# EasyEDA Pro project ProPrj_主控板v1.0_2025-02-24.epro, schematic Schematic2
Board Name: 主控扩展板V1.0; Create Date: 2024-12-04; Page Name: 扩展接口及端子; Project Name: 主控板v1.0; Schematic Name: Schematic2; Update Date: 2024-12-20; Company: 嘉立创EDA; Page Size: A4; Version: V1.0
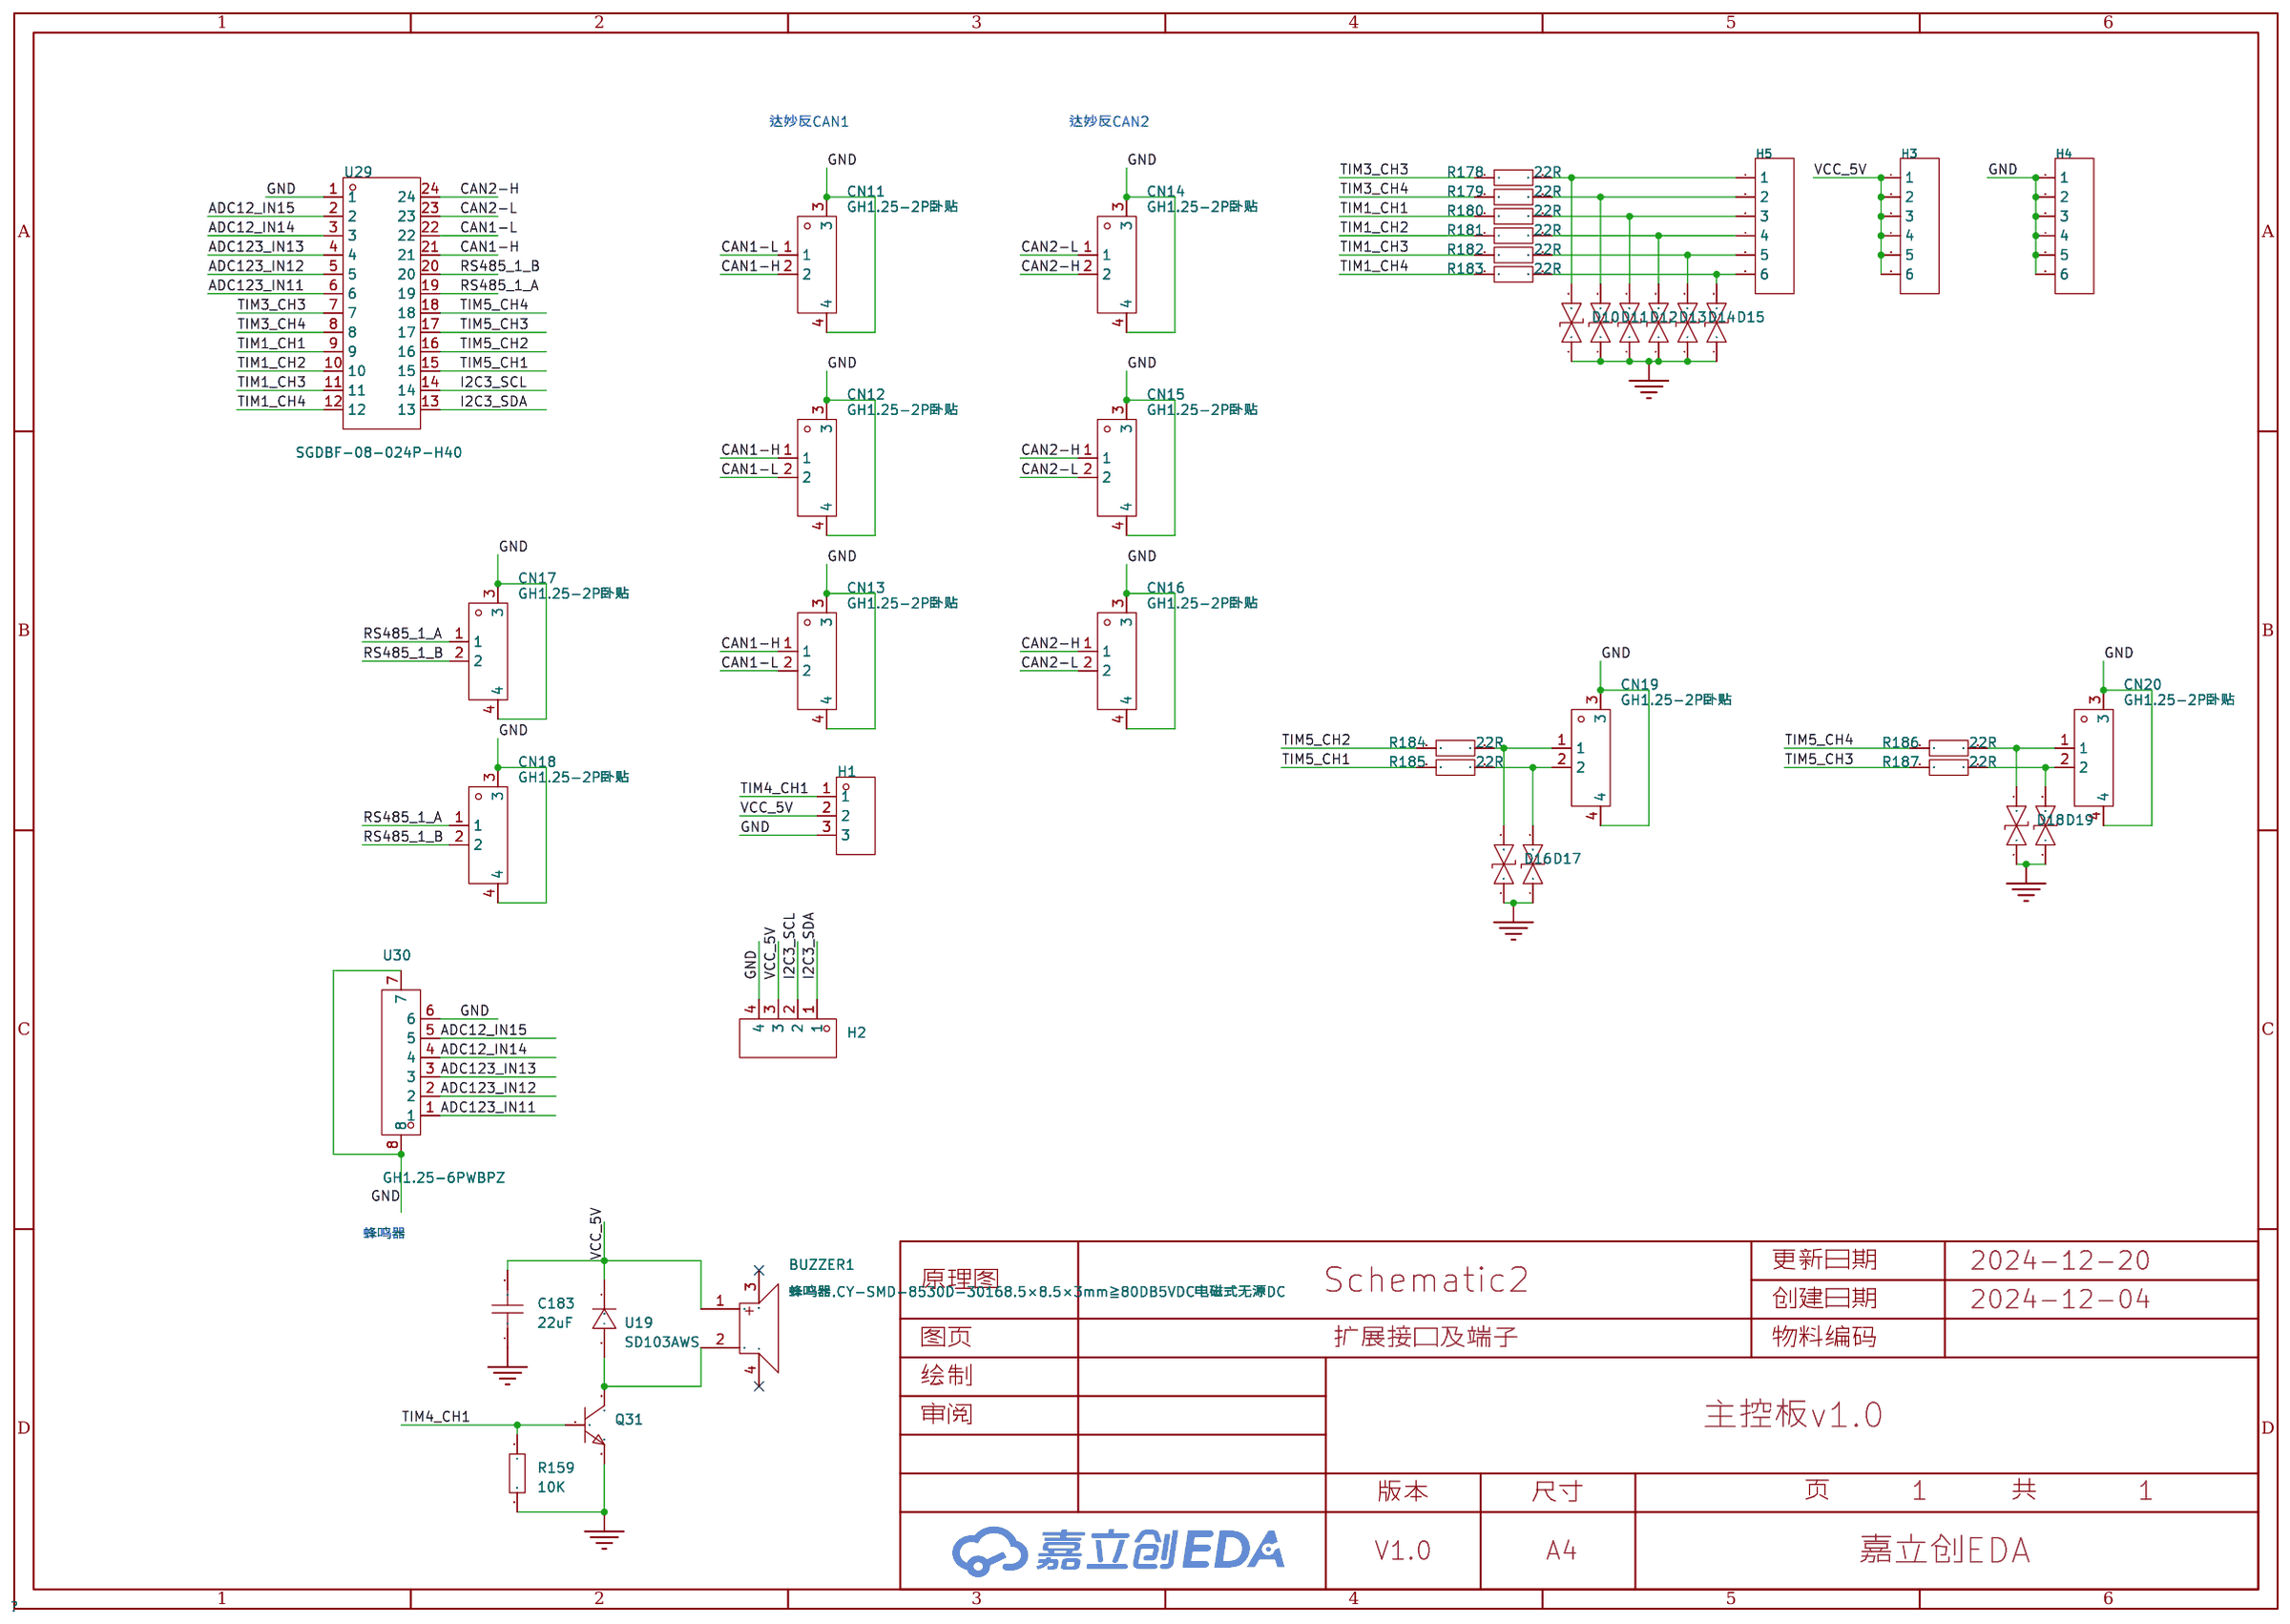
[diagram p6: schematic sheet]

## Parts
BUZZER1  蜂鸣器.CY-SMD-8530D-30168.5×8.5×3mm≧80DB5VDC电磁式无源DC  [BUZ-SMD_4P-L8.5-W8.5-BR-1]
C183  22uF  [C0603]
CN11  GH1.25-2P卧贴  [CONN-SMD_2P-P1.25_X1251WRS-02HF-LPSW]
CN12  GH1.25-2P卧贴  [CONN-SMD_2P-P1.25_X1251WRS-02HF-LPSW]
CN13  GH1.25-2P卧贴  [CONN-SMD_2P-P1.25_X1251WRS-02HF-LPSW]
CN14  GH1.25-2P卧贴  [CONN-SMD_2P-P1.25_X1251WRS-02HF-LPSW]
CN15  GH1.25-2P卧贴  [CONN-SMD_2P-P1.25_X1251WRS-02HF-LPSW]
CN16  GH1.25-2P卧贴  [CONN-SMD_2P-P1.25_X1251WRS-02HF-LPSW]
CN17  GH1.25-2P卧贴  [CONN-SMD_2P-P1.25_X1251WRS-02HF-LPSW]
CN18  GH1.25-2P卧贴  [CONN-SMD_2P-P1.25_X1251WRS-02HF-LPSW]
CN19  GH1.25-2P卧贴  [CONN-SMD_2P-P1.25_X1251WRS-02HF-LPSW]
CN20  GH1.25-2P卧贴  [CONN-SMD_2P-P1.25_X1251WRS-02HF-LPSW]
D10  ESD9B5.0ST5G  [SOD-923_L0.8-W0.6-LS1.0-BI]
D11  ESD9B5.0ST5G  [SOD-923_L0.8-W0.6-LS1.0-BI]
D12  ESD9B5.0ST5G  [SOD-923_L0.8-W0.6-LS1.0-BI]
D13  ESD9B5.0ST5G  [SOD-923_L0.8-W0.6-LS1.0-BI]
D14  ESD9B5.0ST5G  [SOD-923_L0.8-W0.6-LS1.0-BI]
D15  ESD9B5.0ST5G  [SOD-923_L0.8-W0.6-LS1.0-BI]
D16  ESD9B5.0ST5G  [SOD-923_L0.8-W0.6-LS1.0-BI]
D17  ESD9B5.0ST5G  [SOD-923_L0.8-W0.6-LS1.0-BI]
D18  ESD9B5.0ST5G  [SOD-923_L0.8-W0.6-LS1.0-BI]
D19  ESD9B5.0ST5G  [SOD-923_L0.8-W0.6-LS1.0-BI]
H1  -  [HDR-TH_3P-P2.54-V-M]
H2  -  [HDR-TH_4P-P2.54-V-M]
H3  -  [HDR-TH_6P-P2.54-V-M-1]
H4  -  [HDR-TH_6P-P2.54-V-M-1]
H5  -  [HDR-TH_6P-P2.54-V-M-1]
Q31  -  [S8050_SOT-23]
R159  10K  [R0603]
R178  22R  [R0603]
R179  22R  [R0603]
R180  22R  [R0603]
R181  22R  [R0603]
R182  22R  [R0603]
R183  22R  [R0603]
R184  22R  [R0603]
R185  22R  [R0603]
R186  22R  [R0603]
R187  22R  [R0603]
U19  SD103AWS  [SOD-123_L2.7-W1.7-LS3.8-RD]
U29  SGDBF-08-024P-H40  [CONN-SMD_24P-P0.80_SGDBF-08-024P-H40]
U30  GH1.25-6PWBPZ  [CONN-SMD_6P-P1.25_GH1.25-6PWBPZ]

## Library data of the parts
BUZZER1 = 蜂鸣器.CY-SMD-8530D-30168.5×8.5×3mm≧80DB5VDC电磁式无源DC: Supplier Part: C9900015926; Supplier Footprint: SMD; JLCPCB Part Class: 扩展库; Supplier: LCSC
C183 = CAP_0603: Supplier Footprint: 0603
CN11-CN20 = GH1.25-2P卧贴_C9900015099: Supplier Part: C9900015099; JLCPCB Part Class: 扩展库; Supplier: LCSC
D10-D19 = ESD9B5.0ST5G: 极性:双向;反向截止电压(Vrwm):5V;最大钳位电压:-;峰值脉冲功率(Ppp)@10/1000us:-;击穿电压:5.8V;; LCSC Part Name: 双向ESD; Supplier Part: C111566; Manufacturer: onsemi(安森美); Supplier Footprint: SOD-923; JLCPCB Part Class: 扩展库; Datasheet: https://atta.szlcsc.com/upload/public/pdf/source/20170704/1499151283092.PDF; Supplier: LCSC; polarity: 双向; Reverse Stand-Off Voltage (Vrwm): 5V; Breakdown Voltage: 5.8V; Number of Lines: 单路; Operating Temperature: -55℃~+150℃@(Tj); Type: ESD
H1 = HDR-M_2.54_1x3P: Supplier Part: C2937625; Supplier Footprint: 插件
H2 = HDR-M_2.54_1x4P: Supplier Part: C492403; Supplier Footprint: 插件
H3-H5 = HDR-M_2.54_1x6P: Supplier Part: C37208; Supplier Footprint: 插件
Q31 = S8050_SOT_NPN: Supplier Footprint: SOT-23
R159 R178-R187 = Res_0603: Supplier Footprint: 0603
U19 = SD103AWS: Supplier Part: C9900016166; Supplier Footprint: 0805; JLCPCB Part Class: 扩展库; Supplier: LCSC
U29 = SGDBF-08-024P-H40: Supplier Part: C17701770; Supplier Footprint: SMD-24P; JLCPCB Part Class: 扩展库; Supplier: LCSC
U30 = GH1.25-6PWBPZ: LCSC Part Name: GH1.25-6P卧贴编带; Supplier Part: C2829255; Manufacturer: BOOMELE(博穆精密); JLCPCB Part Class: 扩展库; Datasheet: https://atta.szlcsc.com/upload/public/pdf/source/20211125/08A09A4909F58AF780B71FE423A00F7E.pdf; Supplier: LCSC

## Nets
GND: C183.1 CN11.3 CN11.4 CN12.3 CN12.4 CN13.3 CN13.4 CN14.3 CN14.4 CN15.3 CN15.4 CN16.3 CN16.4 CN17.3 CN17.4 CN18.3 CN18.4 CN19.3 CN19.4 CN20.3 CN20.4 D10.1 D11.1 D12.1 D13.1 D14.1 D15.1 D16.1 D17.1 D18.1 D19.1 H1.3 H2.4 H4.1 H4.2 H4.3 H4.4 H4.5 H4.6 Q31.2 R159.2 U29.1 U30.6 U30.7 U30.8
VCC_5V: BUZZER1.1 C183.2 H1.2 H2.3 H3.1 H3.2 H3.3 H3.4 H3.5 H3.6 U19.1(C)
ADC12_IN14: U29.3 U30.4
ADC12_IN15: U29.2 U30.5
ADC123_IN11: U29.6 U30.1
ADC123_IN12: U29.5 U30.2
ADC123_IN13: U29.4 U30.3
CAN1-H: CN11.2 CN12.1 CN13.1 U29.21
CAN1-L: CN11.1 CN12.2 CN13.2 U29.22
CAN2-H: CN14.2 CN15.1 CN16.1 U29.24
CAN2-L: CN14.1 CN15.2 CN16.2 U29.23
I2C3_SCL: H2.2 U29.14
I2C3_SDA: H2.1 U29.13
RS485_1_A: CN17.1 CN18.1 U29.19
RS485_1_B: CN17.2 CN18.2 U29.20
TIM1_CH1: R180.1 U29.9
TIM1_CH2: R181.1 U29.10
TIM1_CH3: R182.1 U29.11
TIM1_CH4: R183.1 U29.12
TIM3_CH3: R178.1 U29.7
TIM3_CH4: R179.1 U29.8
TIM4_CH1: H1.1 Q31.1 R159.1
TIM5_CH1: R185.1 U29.15
TIM5_CH2: R184.1 U29.16
TIM5_CH3: R187.1 U29.17
TIM5_CH4: R186.1 U29.18
$1N2455: D10.2 H5.1 R178.2
$1N2456: D11.2 H5.2 R179.2
$1N2457: D12.2 H5.3 R180.2
$1N2458: D13.2 H5.4 R181.2
$1N2790: D14.2 H5.5 R182.2
$1N2795: D15.2 H5.6 R183.2
$1N3267: CN19.1 D16.2 R184.2
$1N3268: CN19.2 D17.2 R185.2
$1N3411: CN20.1 D18.2 R186.2
$1N3412: CN20.2 D19.2 R187.2
$1N3770: BUZZER1.2 Q31.3 U19.2(A)

Not connected (* = marked no-connect by the designer): BUZZER1 3* 4*

## Notes on the sheet
- 达妙反CAN1
- 达妙反CAN2
- 蜂鸣器
